# Altium schematic sheet inAmp.SchDoc
size A4
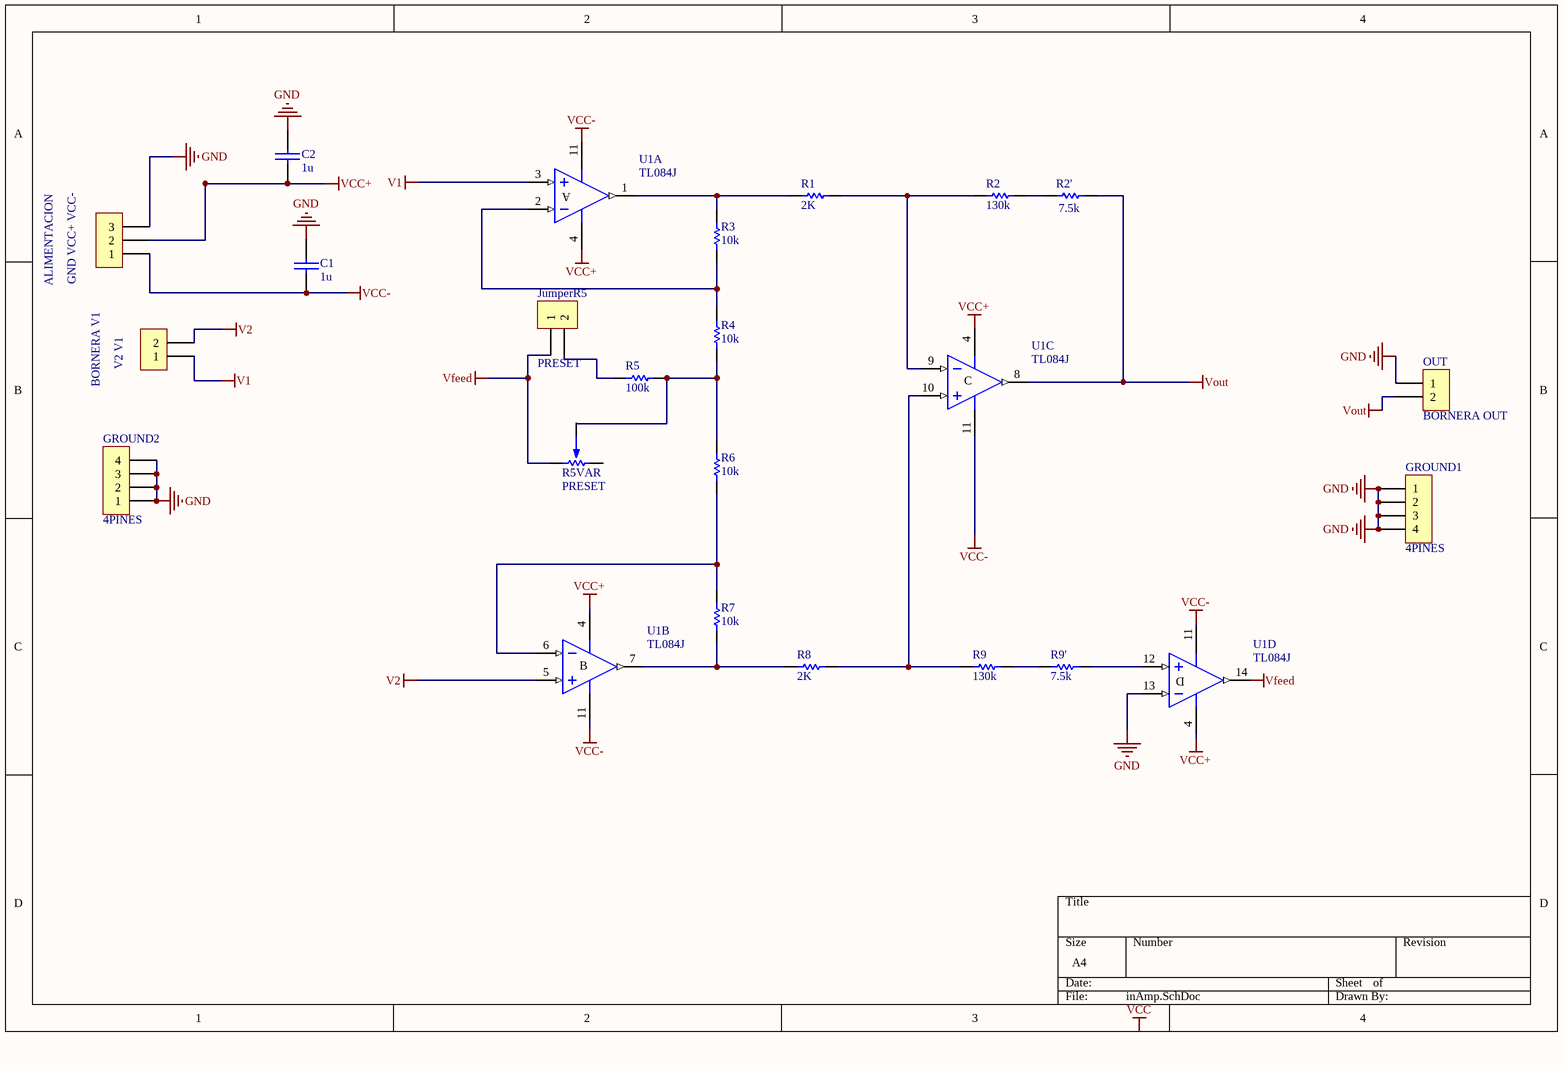
[diagram p0: inAmp.SchDoc]

## Parts
C1  1u  [0805]
C2  1u  [0805]
GND_VCC+_VCC-  ALIMENTACION  [BORNERA3]
GROUND1  4PINES  [SIP4]
GROUND2  4PINES  [SIP4]
JumperR5  PRESET  [SIP2]
OUT  BORNERA OUT  [BORNERA2]
R1  2K  [0805]
R2  130k  [0805]
R2'  7.5k  [0805]
R3  10k  [0805]
R4  10k  [0805]
R5  100k  [0805]
R5VAR  PRESET  [PRESET V]
R6  10k  [0805]
R7  10k  [0805]
R8  2K  [0805]
R9  130k  [0805]
R9'  7.5k  [0805]
U1  TL084J  [J014]  (parts A,B,C,D of 4)
V2_V1  BORNERA V1  [BORNERA2]

## Nets
GND: C1.1 C2.1 GND_VCC+_VCC-.3 GROUND1.1 GROUND1.2 GROUND1.3 GROUND1.4 GROUND2.1 GROUND2.2 GROUND2.3 GROUND2.4 OUT.1 U1.13(IN-)
V1: U1.3(IN+) V2_V1.1
V2: U1.5(IN+) V2_V1.2
VCC+: C2.2 GND_VCC+_VCC-.2 U1.4(V+)
VCC-: C1.2 GND_VCC+_VCC-.1 U1.11(V-)
Vfeed: JumperR5.1 R5VAR.1 U1.14(OUT)
Vout: OUT.2 R2'.2 U1.8(OUT)
NetJumperR5_2: JumperR5.2 R5.2
NetR1_1: R1.1 R2.2 U1.9(IN-)
NetR1_2: R1.2 R3.2 U1.1(OUT)
NetR2_1: R2.1 R2'.1
NetR3_1: R3.1 R4.2 U1.2(IN-)
NetR4_1: R4.1 R5.1 R5VAR.2 R6.2
NetR6_1: R6.1 R7.2 U1.6(IN-)
NetR7_1: R7.1 R8.2 U1.7(OUT)
NetR8_1: R8.1 R9.2 U1.10(IN+)
NetR9'_2: R9'.2 U1.12(IN+)
NetR9_1: R9.1 R9'.1

Not connected (* = marked no-connect by the designer): R5VAR 3

## Notes on the sheet
- Labels drawn without touching a wire or pin: VCC
- (in symbol TL084J, part A) A
- (in symbol TL084J, part B) B
- (in symbol TL084J, part C) C
- (in symbol TL084J, part D) D

## Library data of the parts
C1 C2 = CAP
GND_VCC+_VCC- = BORNERA 3
GROUND1 GROUND2 = CON4
JumperR5 = CON2
OUT V2_V1 = BORNERA 2
R1 R2 R2' R3-R9 R9' = RES
U1 = TL084J: JFET-Input Operational Amplifier; Published: 16-Jan-2001; LatestRevisionDate: 04-Mar-2005; LatestRevisionNote: Stylized 3D Model Added.; DatasheetVersion: Feb-1999; PackageVersion: Jun-1999; PackageReference: J014; Publisher: Altium Limited; PackageDescription: DIP; 14 Leads; Row Spacing 7.62 mm; Pitch 2.54 mm; ComponentLink1Description: Manufacturer Link; ComponentLink1URL: http://www.ti.com/; ComponentLink2Description: Datasheet; ComponentLink2URL: http://www-s.ti.com/sc/ds/tl084.pdf